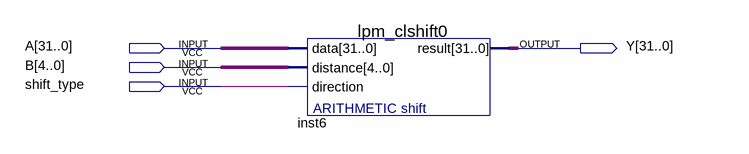
[diagram p0: schematic sheet]
// Quartus schematic ALU_shift.bdf as structural Verilog: 1 symbols, 4 pins
module ALU_shift (
  input  [31:0] A,
  input  [4:0] B,
  input  shift_type,
  output [31:0] Y
);

  lpm_clshift0 inst6 (.data(A), .distance(B), .direction(shift_type), .result(Y));
endmodule
